# EAGLE design actuatorboard (EAGLE 8.7.1)
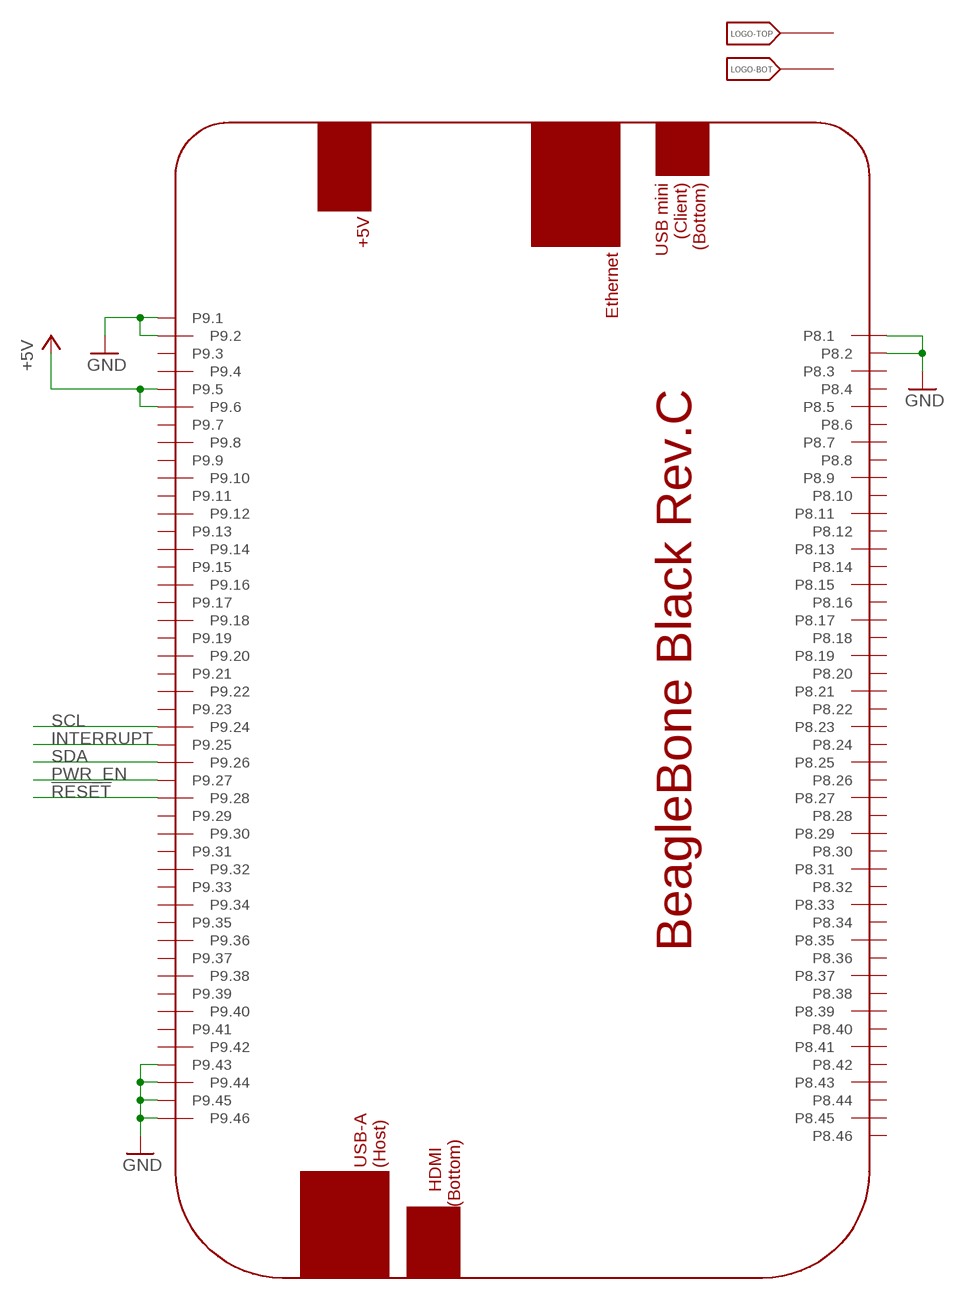
[diagram p0: schematic, sheet 1, part 1 of 2]
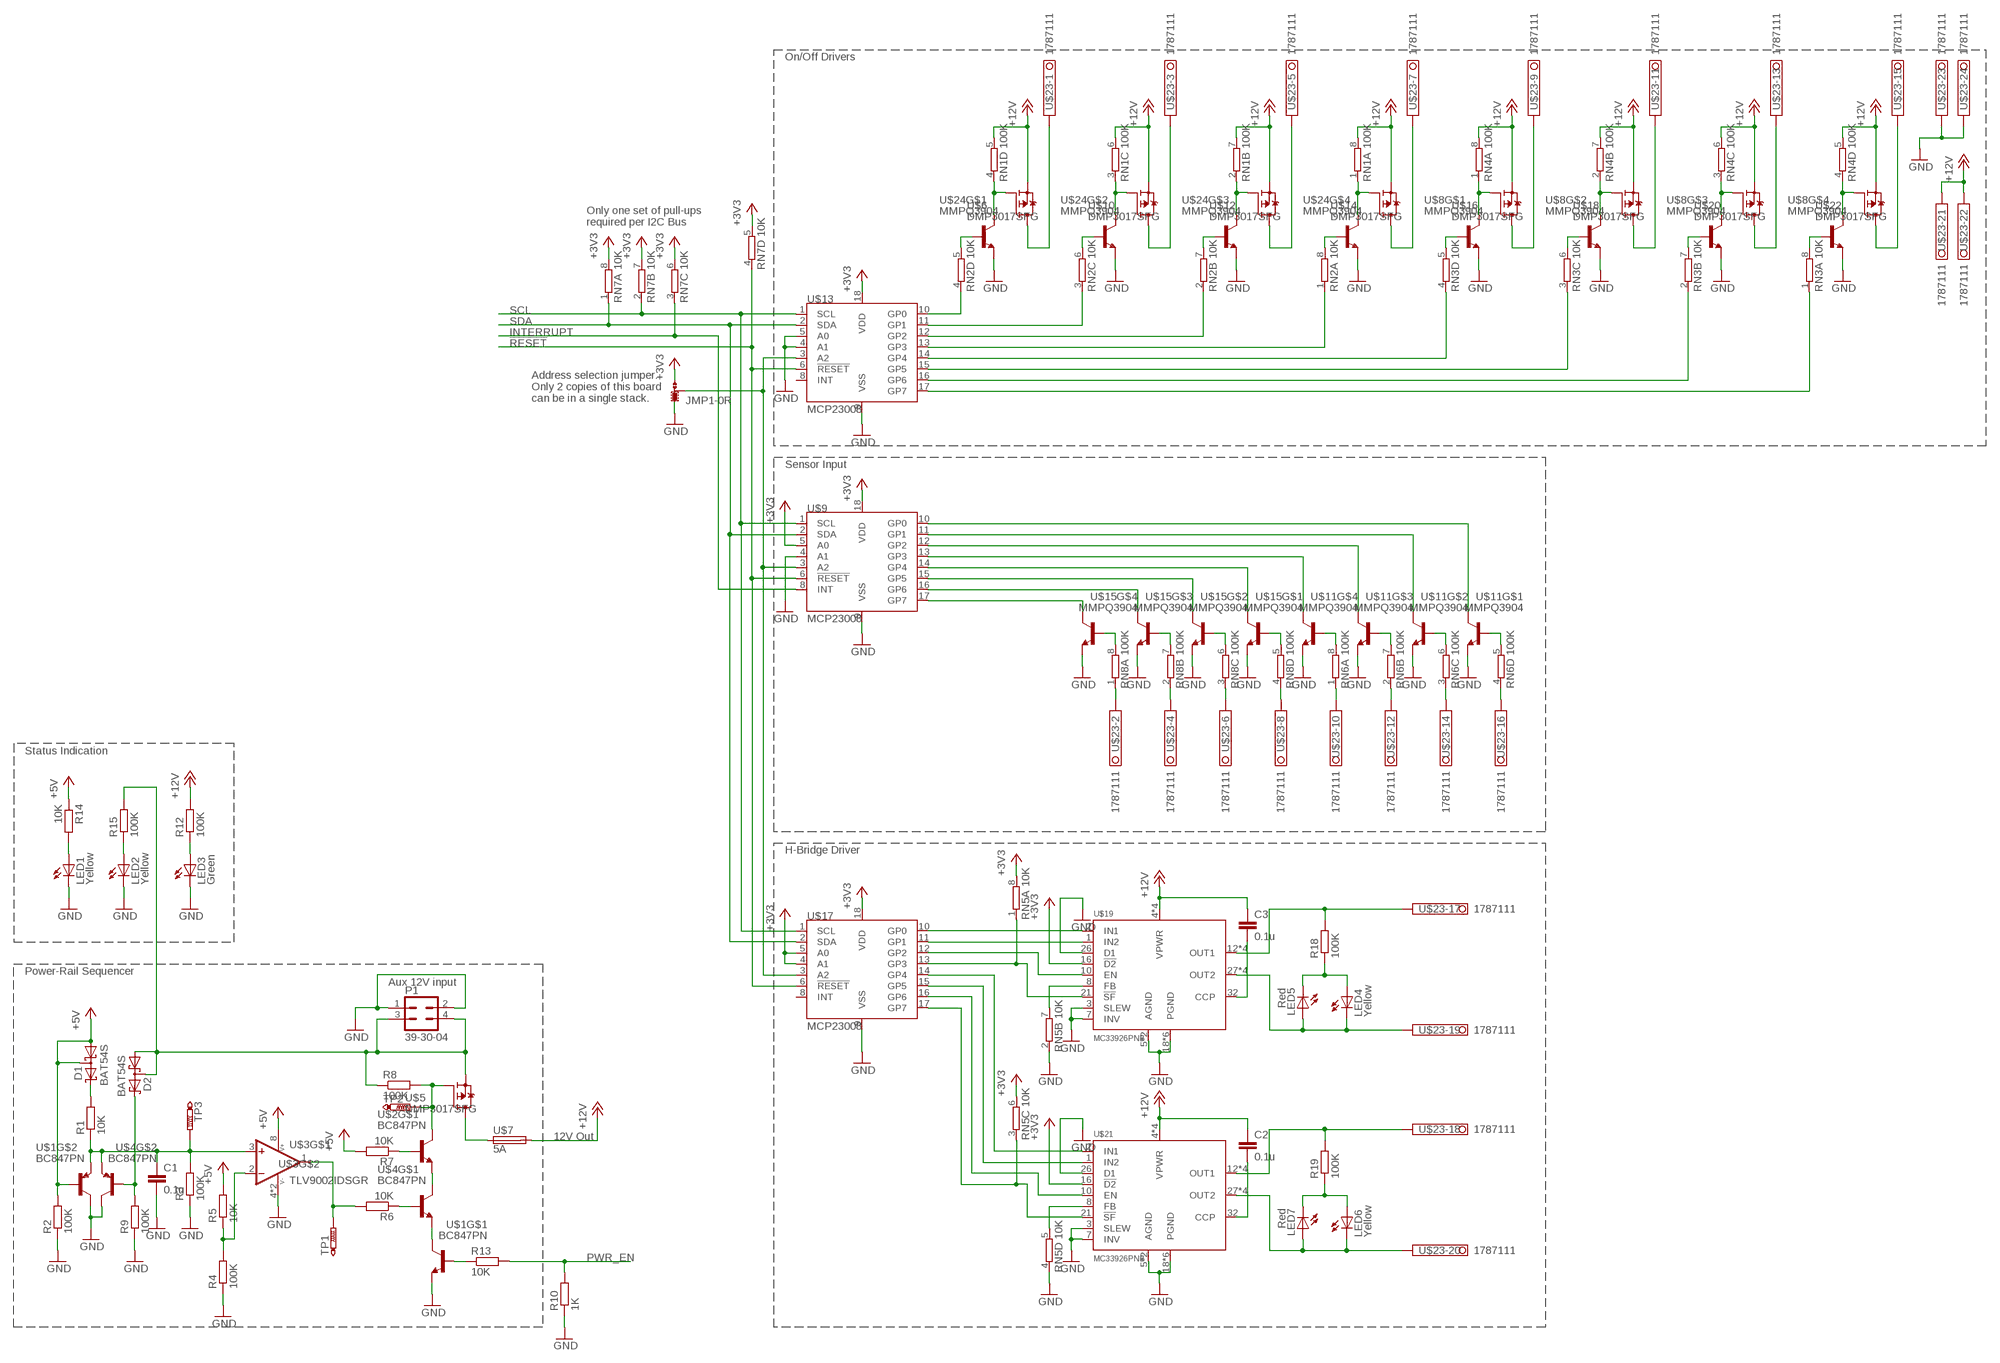
[diagram p1: schematic, sheet 1, part 2 of 2]

## Parts
C1  0.1u  C-EUC0805  [C0805]
C2  0.1u  C-EUC0805  [C0805]
C3  0.1u  C-EUC0805  [C0805]
D1  BAT54S  [SOT23]
D2  BAT54S  [SOT23]
JMP1  0R-JUMPA  [A0R-JMP]
LED1  Yellow  LEDCHIPLED_0805  [CHIPLED_0805]
LED2  Yellow  LEDCHIPLED_0805  [CHIPLED_0805]
LED3  Green  LEDCHIPLED_0805  [CHIPLED_0805]
LED4  Yellow  LEDCHIPLED_0805  [CHIPLED_0805]
LED5  Red  LEDCHIPLED_0805  [CHIPLED_0805]
LED6  Yellow  LEDCHIPLED_0805  [CHIPLED_0805]
LED7  Red  LEDCHIPLED_0805  [CHIPLED_0805]
LOGO  SU_LOGO-DUMMY  [SU_LOGO_DS]
P1  39-30-04  [39-30-?04?]
PCB1  BEAGLEBONE_BLACK_CAPENO_ETH  [BEAGLEBONE_BLACK_CAPE_NO_ETH]
R1  10K  R-EU_R0805  [R0805]
R2  100K  R-EU_R0805  [R0805]
R3  100K  R-EU_R0805  [R0805]
R4  100K  R-EU_R0805  [R0805]
R5  10K  R-EU_R0805  [R0805]
R6  10K  R-EU_R0805  [R0805]
R7  10K  R-EU_R0805  [R0805]
R8  100K  R-EU_R0805  [R0805]
R9  100K  R-EU_R0805  [R0805]
R10  1K  R-EU_R0805  [R0805]
R12  100K  R-EU_R0805  [R0805]
R13  10K  R-EU_R0805  [R0805]
R14  10K  R-EU_R0805  [R0805]
R15  100K  R-EU_R0805  [R0805]
R18  100K  R-EU_R0805  [R0805]
R19  100K  R-EU_R0805  [R0805]
RN1  100K  4R-NEXBV8V  [EXBV8V]
RN2  10K  4R-NEXBV8V  [EXBV8V]
RN3  10K  4R-NEXBV8V  [EXBV8V]
RN4  100K  4R-NEXBV8V  [EXBV8V]
RN5  10K  4R-NEXBV8V  [EXBV8V]
RN6  100K  4R-NEXBV8V  [EXBV8V]
RN7  10K  4R-NEXBV8V  [EXBV8V]
RN8  100K  4R-NEXBV8V  [EXBV8V]
TP1  PTR1B1,27  [B1,27]
TP2  PTR1B1,27  [B1,27]
TP3  PTR1B1,27  [B1,27]
U$1  BC847PN  [SOT363-INFINION]
U$2  BC847PN  [SOT363-INFINION]
U$3  TLV9002IDSGR  [S-PWSON-N8]
U$4  BC847PN  [SOT363-INFINION]
U$5  DMP3017SFG  [POWERDI3333-8]
U$6  DMP3017SFG  [POWERDI3333-8]
U$7  5A  SMD1206  [SMD-1206]
U$8  MMPQ3904  [SOIC-16]
U$9  MCP23008  [SO-18W]
U$10  DMP3017SFG  [POWERDI3333-8]
U$11  MMPQ3904  [SOIC-16]
U$12  DMP3017SFG  [POWERDI3333-8]
U$13  MCP23008  [SO-18W]
U$14  DMP3017SFG  [POWERDI3333-8]
U$15  MMPQ3904  [SOIC-16]
U$16  DMP3017SFG  [POWERDI3333-8]
U$17  MCP23008  [SO-18W]
U$18  DMP3017SFG  [POWERDI3333-8]
U$19  MC33926PNB  [PQFN-32]
U$20  DMP3017SFG  [POWERDI3333-8]
U$21  MC33926PNB  [PQFN-32]
U$22  DMP3017SFG  [POWERDI3333-8]
U$23  1787111  [1787111]
U$24  MMPQ3904  [SOIC-16]

## Nets
!RESET!: PCB1.P9.28 RN7.4 U$9.6(!RESET!) U$13.6(!RESET!) U$17.6(!RESET!)
+3V3: JMP1.3 RN5.6 RN5.8 RN7.5 RN7.6 RN7.7 RN7.8 U$9.5(A0) U$9.18(VDD) U$13.18(VDD) U$17.4(A1) U$17.5(A0) U$17.18(VDD) U$19.16(!D2!) U$21.16(!D2!)
+5V: D1.1(A1) D1.3(C1A2) PCB1.P9.5 PCB1.P9.6 R2.2 R5.2 R7.2 R14.1 U$1.5(B) U$3.8(V+)
+12V: C2.1 C3.1 R12.2 RN1.5 RN1.6 RN1.7 RN1.8 RN4.5 RN4.6 RN4.7 RN4.8 U$6.P$1(S) U$6.P$2(S) U$6.P$3(S) U$7.2 U$10.P$1(S) U$10.P$2(S) U$10.P$3(S) U$12.P$1(S) U$12.P$2(S) U$12.P$3(S) U$14.P$1(S) U$14.P$2(S) U$14.P$3(S) U$16.P$1(S) U$16.P$2(S) U$16.P$3(S) U$18.P$1(S) U$18.P$2(S) U$18.P$3(S) U$19.4(VPWR) U$19.6(VPWR) U$19.11(VPWR) U$19.31(VPWR) U$20.P$1(S) U$20.P$2(S) U$20.P$3(S) U$21.4(VPWR) U$21.6(VPWR) U$21.11(VPWR) U$21.31(VPWR) U$22.P$1(S) U$22.P$2(S) U$22.P$3(S) U$23.21 U$23.22
GND: C1.2 JMP1.1 LED1.C LED2.C LED3.C P1.1 P1.2 PCB1.P8.1 PCB1.P8.2 PCB1.P9.1 PCB1.P9.2 PCB1.P9.43 PCB1.P9.44 PCB1.P9.45 PCB1.P9.46 R2.1 R3.1 R4.1 R9.1 R10.1 RN5.2 RN5.4 U$1.1(E) U$1.3(C) U$3.4(V-) U$3.PAD(V-) U$4.3(C) U$8.P$10(E) U$8.P$12(E) U$8.P$14(E) U$8.P$16(E) U$9.4(A1) U$9.9(VSS) U$11.P$10(E) U$11.P$12(E) U$11.P$14(E) U$11.P$16(E) U$13.4(A1) U$13.5(A0) U$13.9(VSS) U$15.P$10(E) U$15.P$12(E) U$15.P$14(E) U$15.P$16(E) U$17.9(VSS) U$19.3(SLEW) U$19.5(AGND) U$19.7(INV) U$19.18(PGND) U$19.19(PGND) U$19.20(PGND) U$19.22(PGND) U$19.23(PGND) U$19.24(PGND) U$19.26(D1) U$19.PAD(AGND) U$21.3(SLEW) U$21.5(AGND) U$21.7(INV) U$21.18(PGND) U$21.19(PGND) U$21.20(PGND) U$21.22(PGND) U$21.23(PGND) U$21.24(PGND) U$21.26(D1) U$21.PAD(AGND) U$23.23 U$23.24 U$24.P$10(E) U$24.P$12(E) U$24.P$14(E) U$24.P$16(E)
INTERRUPT: PCB1.P9.25 RN7.3 U$9.8(INT)
N$1: D2.2(C2) R9.2 U$4.5(B)
N$2: C1.1 R1.1 R3.2 TP3.TP U$1.4(E) U$3.3(+IN) U$4.4(E)
N$3: R4.2 R5.1 U$3.2(-IN)
N$4: U$1.6(C) U$4.1(E)
N$5: R6.1 U$4.2(B)
N$6: R6.2 TP1.TP U$3.1(OUT)
N$7: U$2.1(E) U$4.6(C)
N$8: U$5.P$5(D) U$5.P$6(D) U$5.P$7(D) U$5.P$8(D) U$7.1
N$9: R7.1 U$2.2(B)
N$10: D1.2(C2) R1.2
N$11: U$6.P$5(D) U$6.P$6(D) U$6.P$7(D) U$6.P$8(D) U$23.1
N$12: D2.1(A1) D2.3(C1A2) P1.3 P1.4 R8.1 R15.2 U$5.P$1(S) U$5.P$2(S) U$5.P$3(S)
N$13: R8.2 TP2.TP U$2.6(C) U$5.P$4(G)
N$14: R13.1 U$1.2(B)
N$15: RN1.4 U$6.P$4(G) U$24.P$1(C) U$24.P$2(C)
N$16: RN2.4 U$13.10(GP0)
N$17: RN2.5 U$24.P$15(B)
N$18: U$17.10(GP0) U$19.2(IN1)
N$19: U$17.11(GP1) U$19.1(IN2)
N$20: LED1.A R14.2
N$21: LED2.A R15.1
N$22: LED3.A R12.1
N$23: U$10.P$5(D) U$10.P$6(D) U$10.P$7(D) U$10.P$8(D) U$23.3
N$24: RN1.3 U$10.P$4(G) U$24.P$3(C) U$24.P$4(C)
N$25: RN2.6 U$24.P$13(B)
N$26: RN2.3 U$13.11(GP1)
N$27: U$12.P$5(D) U$12.P$6(D) U$12.P$7(D) U$12.P$8(D) U$23.5
N$28: RN1.2 U$12.P$4(G) U$24.P$5(C) U$24.P$6(C)
N$29: RN2.7 U$24.P$11(B)
N$30: RN2.2 U$13.12(GP2)
N$31: U$14.P$5(D) U$14.P$6(D) U$14.P$7(D) U$14.P$8(D) U$23.7
N$32: RN1.1 U$14.P$4(G) U$24.P$7(C) U$24.P$8(C)
N$33: RN2.8 U$24.P$9(B)
N$34: RN2.1 U$13.13(GP3)
N$35: U$17.12(GP2) U$19.10(EN)
N$36: RN6.2 U$23.12
N$37: U$16.P$5(D) U$16.P$6(D) U$16.P$7(D) U$16.P$8(D) U$23.9
N$38: RN4.1 U$8.P$1(C) U$8.P$2(C) U$16.P$4(G)
N$39: RN3.5 U$8.P$15(B)
N$40: RN3.4 U$13.14(GP4)
N$41: U$18.P$5(D) U$18.P$6(D) U$18.P$7(D) U$18.P$8(D) U$23.11
N$42: RN4.2 U$8.P$3(C) U$8.P$4(C) U$18.P$4(G)
N$43: RN3.6 U$8.P$13(B)
N$44: RN3.3 U$13.15(GP5)
N$45: U$20.P$5(D) U$20.P$6(D) U$20.P$7(D) U$20.P$8(D) U$23.13
N$46: RN4.3 U$8.P$5(C) U$8.P$6(C) U$20.P$4(G)
N$47: RN3.7 U$8.P$11(B)
N$48: RN3.2 U$13.16(GP6)
N$49: U$22.P$5(D) U$22.P$6(D) U$22.P$7(D) U$22.P$8(D) U$23.15
N$50: RN4.4 U$8.P$7(C) U$8.P$8(C) U$22.P$4(G)
N$51: RN3.8 U$8.P$9(B)
N$52: RN3.1 U$13.17(GP7)
N$53: U$9.10(GP0) U$11.P$1(C) U$11.P$2(C)
N$54: U$9.11(GP1) U$11.P$3(C) U$11.P$4(C)
N$55: RN6.5 U$11.P$15(B)
N$56: U$9.12(GP2) U$11.P$5(C) U$11.P$6(C)
N$57: U$9.13(GP3) U$11.P$7(C) U$11.P$8(C)
N$58: U$9.14(GP4) U$15.P$1(C) U$15.P$2(C)
N$59: U$9.15(GP5) U$15.P$3(C) U$15.P$4(C)
N$60: U$9.16(GP6) U$15.P$5(C) U$15.P$6(C)
N$61: U$9.17(GP7) U$15.P$7(C) U$15.P$8(C)
N$62: RN6.6 U$11.P$13(B)
N$63: RN6.7 U$11.P$11(B)
N$64: RN6.8 U$11.P$9(B)
N$65: RN8.5 U$15.P$15(B)
N$66: RN5.1 U$17.13(GP3) U$19.21(!SF!)
N$67: RN5.7 U$19.8(FB)
N$68: U$17.14(GP4) U$21.2(IN1)
N$69: U$17.15(GP5) U$21.1(IN2)
N$70: RN8.6 U$15.P$13(B)
N$71: RN8.7 U$15.P$11(B)
N$72: RN8.8 U$15.P$9(B)
N$73: U$17.16(GP6) U$21.10(EN)
N$74: RN5.3 U$17.17(GP7) U$21.21(!SF!)
N$75: RN5.5 U$21.8(FB)
N$76: LED4.A LED5.C R18.1
N$77: LED4.C LED5.A U$19.27(OUT2) U$19.28(OUT2) U$19.29(OUT2) U$19.30(OUT2) U$23.19
N$78: RN8.1 U$23.2
N$79: R18.2 U$19.12(OUT1) U$19.13(OUT1) U$19.14(OUT1) U$19.15(OUT1) U$23.17
N$80: LED6.A LED7.C R19.1
N$81: LED6.C LED7.A U$21.27(OUT2) U$21.28(OUT2) U$21.29(OUT2) U$21.30(OUT2) U$23.20
N$82: R19.2 U$21.12(OUT1) U$21.13(OUT1) U$21.14(OUT1) U$21.15(OUT1) U$23.18
N$83: C2.2 U$21.32(CCP)
N$84: C3.2 U$19.32(CCP)
N$85: RN8.2 U$23.4
N$86: RN8.3 U$23.6
N$87: RN8.4 U$23.8
N$88: RN6.1 U$23.10
N$89: RN6.3 U$23.14
N$90: RN6.4 U$23.16
N$92: JMP1.2 U$9.3(A2) U$13.3(A2) U$17.3(A2)
PWR_EN: PCB1.P9.27 R10.2 R13.2
SCL: PCB1.P9.24 RN7.2 U$9.1(SCL) U$13.1(SCL) U$17.1(SCL)
SDA: PCB1.P9.26 RN7.1 U$9.2(SDA) U$13.2(SDA) U$17.2(SDA)
Unconnected: LOGO.P$1 LOGO.P$2 PCB1.P8.3 PCB1.P8.4 PCB1.P8.5 PCB1.P8.6 PCB1.P8.7 PCB1.P8.8 PCB1.P8.9 PCB1.P8.10 PCB1.P8.11 PCB1.P8.12 PCB1.P8.13 PCB1.P8.14 PCB1.P8.15 PCB1.P8.16 PCB1.P8.17 PCB1.P8.18 PCB1.P8.19 PCB1.P8.20 PCB1.P8.21 PCB1.P8.22 PCB1.P8.23 PCB1.P8.24 PCB1.P8.25 PCB1.P8.26 PCB1.P8.27 PCB1.P8.28 PCB1.P8.29 PCB1.P8.30 PCB1.P8.31 PCB1.P8.32 PCB1.P8.33 PCB1.P8.34 PCB1.P8.35 PCB1.P8.36 PCB1.P8.37 PCB1.P8.38 PCB1.P8.39 PCB1.P8.40 PCB1.P8.41 PCB1.P8.42 PCB1.P8.43 PCB1.P8.44 PCB1.P8.45 PCB1.P8.46 PCB1.P9.3 PCB1.P9.4 PCB1.P9.7 PCB1.P9.8 PCB1.P9.9 PCB1.P9.10 PCB1.P9.11 PCB1.P9.12 PCB1.P9.13 PCB1.P9.14 PCB1.P9.15 PCB1.P9.16 PCB1.P9.17 PCB1.P9.18 PCB1.P9.19 PCB1.P9.20 PCB1.P9.21 PCB1.P9.22 PCB1.P9.23 PCB1.P9.29 PCB1.P9.30 PCB1.P9.31 PCB1.P9.32 PCB1.P9.33 PCB1.P9.34 PCB1.P9.35 PCB1.P9.36 PCB1.P9.37 PCB1.P9.38 PCB1.P9.39 PCB1.P9.40 PCB1.P9.41 PCB1.P9.42 U$2.3(C) U$2.4(E) U$2.5(B) U$3.5(+IN) U$3.6(-IN) U$3.7(OUT) U$13.8(INT) U$17.8(INT)

## Notes on the sheet
- On/Off Drivers
- Only one set of pull-ups 
  required per I2C Bus
- Address selection jumper.
  Only 2 copies of this board
  can be in a single stack.
- Sensor Input
- Status Indication
- H-Bridge Driver
- Power-Rail Sequencer
- Aux 12V input
- 12V Out

## Library data of the parts
C1-C3 = rcl:C-EU: CAPACITOR, European symbol
D1 D2 = diode:BAT54S: Schottky Diodes Pin connection corrected 2011-05-04 Source: Fairchild .. BAT54.pdf
JMP1 = jump-0r-smd:0R-JUMP: SMD 0R 0805 Jumper
LED1-LED7 = led:LED: LED OSRAM: - CHIPLED LG R971, LG N971, LY N971, LG Q971, LY Q971, LO R971, LY R971 LH N974, LH R974 LS Q976, LO Q976, LY Q976 LO Q996 - Hyper CHIPLED LW Q18S LB Q993, LB Q99A, LB R99A - SideLED LS A670, LO A670, LY A670, LG A670, LP A670 LB A673, LV A673, LT A673, LW A673 LH A674 LY A675 LS A676, LA A676, LO A676, LY A676, LW A676 LS A679, LY A679, LG A679 - Hyper Micro SIDELED® LS Y876, LA Y876, LO Y876, LY Y876 LT Y87S - SmartLED LW L88C, LW L88S LB L89C, LB L89S, LG L890 LS L89K, LO L89K, LY L89K LS L896, LA L896, LO L896, LY L896 - TOPLED LS T670, LO T670, LY T670, LG T670, LP T670 LSG T670, LSP T670, LSY T670, LOP T670, LYG T670 LG T671, LOG T671, LSG T671 LB T673, LV T673, LT T673, LW T673 LH T674 LS T676, LA T676, LO T676, LY T676, LB T676, LH T676, LSB T676, LW T676 LB T67C, LV T67C, LT T67C, LS T67K, LO T67K, LY T67K, LW E67C LS E67B, LA E67B, LO E67B, LY E67B, LB E67C, LV E67C, LT E67C LW T67C LS T679, LY T679, LG T679 LS T770, LO T770, LY T770, LG T770, LP T770 LB T773, LV T773, LT T773, LW T773 LH T774 LS E675, LA E675, LY E675, LS T675 LS T776, LA T776, LO T776, LY T776, LB T776 LHGB T686 LT T68C, LB T68C - Hyper Mini TOPLED® LB M676 - Mini TOPLED Santana® LG M470 LS M47K, LO M47K, LY M47K Source: http://www.osram.convergy.de LUXEON: - LUMILED® LXK2-PW12-R00, LXK2-PW12-S00, LXK2-PW14-U00, LXK2-PW14-V00 LXK2-PM12-R00, LXK2-PM12-S00, LXK2-PM14-U00 LXK2-PE12-Q00, LXK2-PE12-R00, LXK2-PE12-S00, LXK2-PE14-T00, LXK2-PE14-U00 LXK2-PB12-K00, LXK2-PB12-L00, LXK2-PB12-M00, LXK2-PB14-N00, LXK2-PB14-P00, LXK2-PB14-Q00 LXK2-PR12-L00, LXK2-PR12-M00, LXK2-PR14-Q00, LXK2-PR14-R00 LXK2-PD12-Q00, LXK2-PD12-R00, LXK2-PD12-S00 LXK2-PH12-R00, LXK2-PH12-S00 LXK2-PL12-P00, LXK2-PL12-Q00, LXK2-PL12-R00 Source: www.luxeon.com KINGBRIGHT: KA-3528ASYC Source: www.kingbright.com
LOGO = components:SU_LOGO-DUMMY
P1 = con-molex-mini-fit:39-30-?04?: HEADER
PCB1 = e14_BeagleBoneBlack_RevB:BEAGLEBONE_BLACK_CAPE
R1-R10 R12-R15 R18 R19 = rcl:R-EU_: RESISTOR, European symbol
RN1-RN8 = resistor-dil:4R-N: Array Chip Resistor Source: RS Component / Phycomp; OC_FARNELL: unknown; OC_NEWARK: unknown
TP1-TP3 = testpad:PTR1: TEST PIN
U$1 U$2 U$4 = transistor:BC847PN: NPN/PNP Transistor array 1 NPN, 1 PNP
U$3 = texas:TLV: OP Amp Low-power rail-to-rail opperational amplifier. 1.8 - 5.5V
U$5 U$6 U$10 U$12 U$14 U$16 U$18 U$20 U$22 = transistor-fet:DMP3017SFG: P-Channel Mosfet Depricated! Replaced by: DMP3013SFV Id - Continuous Drain Current: - 30 A Pd - Power Dissipation: 31 W Vgs th - Gate-Source Threshold Voltage: - 1 V
U$7 = fuse:SMD: SMD Fuse
U$8 U$11 U$15 U$24 = on-semiconductor:MMPQ3904: NPN Transistor Array Quad NPN Transistor array
U$9 U$13 U$17 = microchip:MCP23008: 8-Bit IO-Expander I2C/SPI 8-Bit I/O Expander with Serial Interface.
U$19 U$21 = nxp:MC33926: H-Bridge 5A 5.0A trottle conrol H-bridge
U$23 = con-phoenix-350:1787111: DMC_1,5/12-G1F-3,5-LR_P20THR Pluggable Terminal Blocks 12 Pos 3.5mm Dbl Row Through Hole Header

## Net classes
0 default: clearance 0.205 mm

## Board
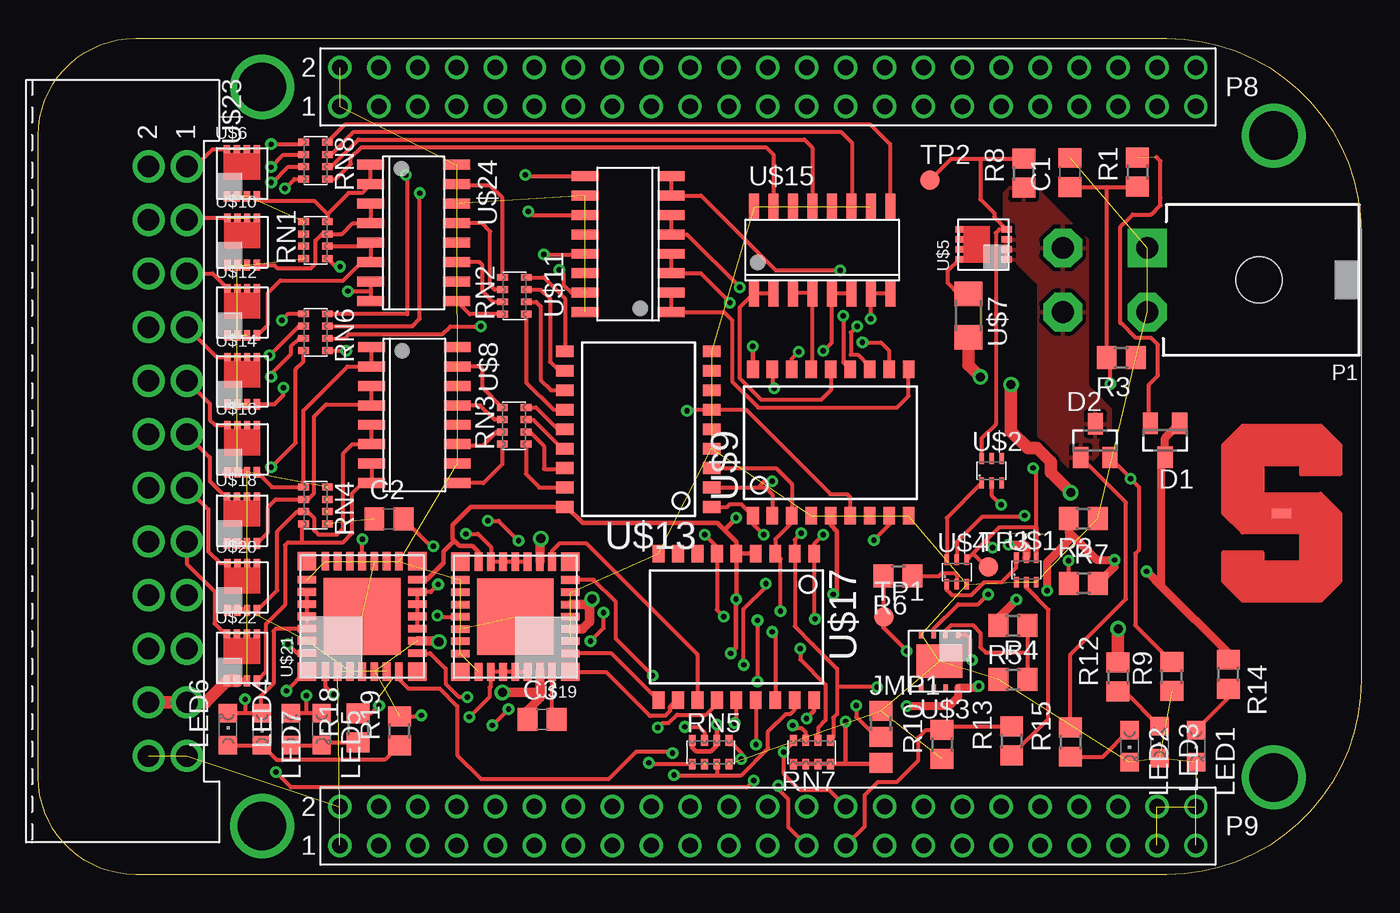
[diagram p2: board, top side]
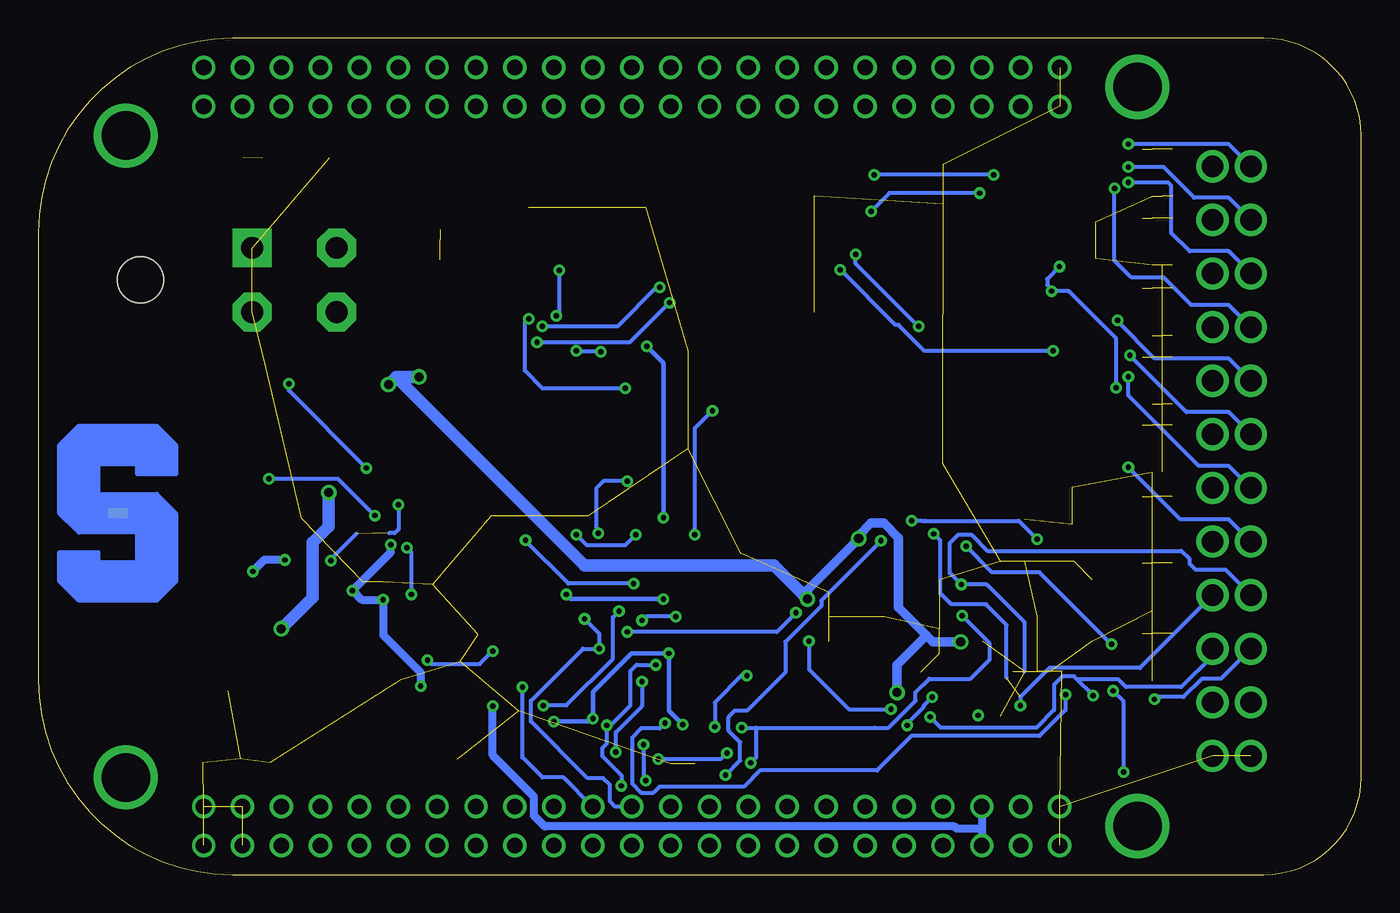
[diagram p3: board, bottom side, seen from below]

Size 86.36 x 54.61 mm. Coordinates in mm from the lower left corner, seen from the top.
Copper layers (1*16): Top 0.035mm / dielectric 1.5mm / Bottom 0.035mm
Design rules "default": minimum track width 10mil, minimum drill 24mil, track to track 8mil, track to pad 8mil, pad to pad 8mil, via to via 8mil, smd to smd 8mil, copper to edge 40mil, drill to drill 8mil, minimum pad ring 10mil, minimum via ring 8mil, stop-mask expansion 4mil, vias tented up to drill 0mil, thermal gap 10mil

### Footprints (pad centres in the part's own frame; a part is rotated, then mirrored left to right if it is on the bottom)
C0805 = smd 1.3 x 1.5: 1 -0.95,0; 2 0.95,0
SOT23 = smd 1 x 1.4: 1 -0.95,-1.1; 2 0.95,-1.1; 3 0,1.1
A0R-JMP = smd 1.5 x 1.3: 1 0,1.7; 2 0,0; 3 0,-1.7
CHIPLED_0805 = smd 1.2 x 1.2: A 0,-1.05; C 0,1.05
SU_LOGO_DS = smd 1.27 x 0.635: P$1 0,0 | smd 1.27 x 0.635 bottom: P$2 0,0
39-30-?04? = drill 1.422 pad 2.54 square: 1 2.095,0 | drill 1.422 pad 2.54 octagon: 2 -2.095,0; 3 2.095,5.512; 4 -2.095,5.512 | hole 3: 0,-7.3
BEAGLEBONE_BLACK_CAPE_NO_ETH = drill 3.175: H1 14.605,3.175; H2 80.645,6.35; H3 80.645,48.26; H4 14.605,51.435 | drill 1.016: P8.1 19.685,50.165; P8.2 19.685,52.705; P8.3 22.225,50.165; P8.4 22.225,52.705; P8.5 24.765,50.165; P8.6 24.765,52.705; P8.7 27.305,50.165; P8.8 27.305,52.705; P8.9 29.845,50.165; P8.10 29.845,52.705; P8.11 32.385,50.165; P8.12 32.385,52.705; P8.13 34.925,50.165; P8.14 34.925,52.705; P8.15 37.465,50.165; P8.16 37.465,52.705; P8.17 40.005,50.165; P8.18 40.005,52.705; P8.19 42.545,50.165; P8.20 42.545,52.705; P8.21 45.085,50.165; P8.22 45.085,52.705; P8.23 47.625,50.165; P8.24 47.625,52.705; P8.25 50.165,50.165; P8.26 50.165,52.705; P8.27 52.705,50.165; P8.28 52.705,52.705; P8.29 55.245,50.165; P8.30 55.245,52.705; P8.31 57.785,50.165; P8.32 57.785,52.705; P8.33 60.325,50.165; P8.34 60.325,52.705; P8.35 62.865,50.165; P8.36 62.865,52.705; P8.37 65.405,50.165; P8.38 65.405,52.705; P8.39 67.945,50.165; P8.40 67.945,52.705; P8.41 70.485,50.165; P8.42 70.485,52.705; P8.43 73.025,50.165; P8.44 73.025,52.705; P8.45 75.565,50.165; P8.46 75.565,52.705; P9.1 19.685,1.905; P9.2 19.685,4.445; P9.3 22.225,1.905; P9.4 22.225,4.445; P9.5 24.765,1.905; P9.6 24.765,4.445; P9.7 27.305,1.905; P9.8 27.305,4.445; P9.9 29.845,1.905; P9.10 29.845,4.445; P9.11 32.385,1.905; P9.12 32.385,4.445; P9.13 34.925,1.905; P9.14 34.925,4.445; P9.15 37.465,1.905; P9.16 37.465,4.445; P9.17 40.005,1.905; P9.18 40.005,4.445; P9.19 42.545,1.905; P9.20 42.545,4.445; P9.21 45.085,1.905; P9.22 45.085,4.445; P9.23 47.625,1.905; P9.24 47.625,4.445; P9.25 50.165,1.905; P9.26 50.165,4.445; P9.27 52.705,1.905; P9.28 52.705,4.445; P9.29 55.245,1.905; P9.30 55.245,4.445; P9.31 57.785,1.905; P9.32 57.785,4.445; P9.33 60.325,1.905; P9.34 60.325,4.445; P9.35 62.865,1.905; P9.36 62.865,4.445; P9.37 65.405,1.905; P9.38 65.405,4.445; P9.39 67.945,1.905; P9.40 67.945,4.445; P9.41 70.485,1.905; P9.42 70.485,4.445; P9.43 73.025,1.905; P9.44 73.025,4.445; P9.45 75.565,1.905; P9.46 75.565,4.445
R0805 = smd 1.3 x 1.5: 1 -0.95,0; 2 0.95,0
EXBV8V = smd 0.45 x 0.7: 1 -1.2,-0.775; 2 -0.4,-0.775; 3 0.4,-0.775; 4 1.2,-0.775; 5 1.2,0.775; 6 0.4,0.775; 7 -0.4,0.775; 8 -1.2,0.775
B1,27 = smd 1.27 x 1.27: TP 0,0
SOT363-INFINION = smd 0.3 x 0.7: 1 -0.65,-0.8; 2 0,-0.8; 3 0.65,-0.8; 4 0.65,0.8; 5 0,0.8; 6 -0.65,0.8
S-PWSON-N8 = smd 0.3 x 0.5: 1 -1.2,-1.75; 2 -0.4,-1.75; 3 0.4,-1.75; 4 1.2,-1.75; 5 1.2,1.75; 6 0.4,1.75; 7 -0.4,1.75; 8 -1.2,1.75 | smd 3 x 2.2: PAD 0,0
POWERDI3333-8 = smd 0.42 x 0.7: P$1 -0.975,-1.5; P$2 -0.325,-1.5; P$3 0.325,-1.5; P$4 0.975,-1.5 | smd 0.42 x 0.54: P$5 0.975,1.58; P$6 0.325,1.58; P$7 -0.325,1.58; P$8 -0.975,1.58
SMD-1206 = smd 1.6 x 1.803: 1 -1.422,0; 2 1.422,0
SOIC-16 = smd 0.65 x 1.75: P$1 -4.445,-2.8; P$2 -3.175,-2.8; P$3 -1.905,-2.8; P$4 -0.635,-2.8; P$5 0.635,-2.8; P$6 1.905,-2.8; P$7 3.175,-2.8; P$8 4.445,-2.8; P$9 4.445,2.8; P$10 3.175,2.8; P$11 1.905,2.8; P$12 0.635,2.8; P$13 -0.635,2.8; P$14 -1.905,2.8; P$15 -3.175,2.8; P$16 -4.445,2.8
SO-18W = smd 0.762 x 1.143: 1 -5.08,-4.788; 2 -3.81,-4.788; 3 -2.54,-4.788; 4 -1.27,-4.788; 5 0,-4.788; 6 1.27,-4.788; 7 2.54,-4.788; 8 3.81,-4.788; 9 5.08,-4.788; 10 5.08,4.788; 11 3.81,4.788; 12 2.54,4.788; 13 1.27,4.788; 14 0,4.788; 15 -1.27,4.788; 16 -2.54,4.788; 17 -3.81,4.788; 18 -5.08,4.788
PQFN-32 = smd 1.2 x 1.2: 1 -3.6,3.6; 9 -3.6,-3.6; 17 3.6,-3.6; 25 3.6,3.6 | smd 1.2 x 0.5: 2 -3.6,2.4; 3 -3.6,1.6; 4 -3.6,0.8; 5 -3.6,0; 6 -3.6,-0.8; 7 -3.6,-1.6; 8 -3.6,-2.4; 18 3.6,-2.4; 19 3.6,-1.6; 20 3.6,-0.8; 21 3.6,0; 22 3.6,0.8; 23 3.6,1.6; 24 3.6,2.4 | smd 0.5 x 1.2: 10 -2.4,-3.6; 11 -1.6,-3.6; 12 -0.8,-3.6; 13 0,-3.6; 14 0.8,-3.6; 15 1.6,-3.6; 16 2.4,-3.6; 26 2.4,3.6; 27 1.6,3.6; 28 0.8,3.6; 29 0,3.6; 30 -0.8,3.6; 31 -1.6,3.6; 32 -2.4,3.6 | smd 5 x 5: PAD 0,0
1787111 = drill 1.4: 1 -19.25,4.7; 2 -19.25,2.2; 3 -15.75,4.7; 4 -15.75,2.2; 5 -12.25,4.7; 6 -12.25,2.2; 7 -8.75,4.7; 8 -8.75,2.2; 9 -5.25,4.7; 10 -5.25,2.2; 11 -1.75,4.7; 12 -1.75,2.2; 13 1.75,4.7; 14 1.75,2.2; 15 5.25,4.7; 16 5.25,2.2; 17 8.75,4.7; 18 8.75,2.2; 19 12.25,4.7; 20 12.25,2.2; 21 15.75,4.7; 22 15.75,2.2; 23 19.25,4.7; 24 19.25,2.2

### Placement (x,y rotation side)
C1  67.35,45.85 90 top
C2  22.89,23.22 0 top
C3  32.89,10.14 0 top
D1  73.55,28.36 180 top
D2  69,28.34 0 top
JMP1  55,9 0 top
LED1  75.59,8.4 180 top
LED2  71.24,8.4 180 top
LED3  73.19,8.65 180 top
LED4  16.5,9.5 0 top
LED5  18.5,9.5 180 top
LED6  12.39,9.5 0 top
LED7  14.61,9.5 180 top
LOGO  81.17,23.6 0 top
P1  39-30-04?  [39-30-?04?]  72.39,38.83 90 top
PCB1  0,0 0 top
R1  71.75,45.87 90 top
R2  68.21,23.25 180 top
R3  70.69,33.75 180 top
R4  63.63,12.75 0 top
R5  63.62,16.26 180 top
R6  56.12,19.5 180 top
R7  68.23,19.02 0 top
R8  64.33,45.8 90 top
R9  73.99,12.94 90 top
R10  59,8.5 90 top
R12  70.48,12.91 90 top
R13  63.54,8.73 90 top
R14  77.67,13.09 270 top
R15  67.38,8.66 90 top
R18  20.88,9.59 90 top
R19  23.58,9.39 90 top
RN1  18.1,41.43 90 top
RN2  31.08,37.8 90 top
RN3  31.06,29.31 90 top
RN4  18.09,24.11 270 top
RN5  43.89,8 0 top
RN6  18.09,35.42 270 top
RN7  50.5,8 180 top
RN8  18.09,46.62 270 top
TP1  55.21,16.84 0 top
TP2  58.21,45.36 0 top
TP3  62.01,20.08 0 top
U$1  64.5,19.9 0 top
U$2  62.23,26.37 0 top
U$3  58.84,13.94 180 top
U$4  59.96,19.76 0 top
U$5  61.71,41.15 90 top
U$6  13.3,45.79 0 top
U$7  60.72,36.5 270 top
U$8  24.55,30.01 270 top
U$9  51.73,28.21 0 top
U$10  13.31,41.3 0 top
U$11  38.5,41.17 90 top
U$12  13.31,36.71 0 top
U$13  39.17,29.09 90 top
U$14  13.31,32.22 0 top
U$15  51.17,40.78 0 top
U$16  13.31,27.78 0 top
U$17  45.57,16.17 180 top
U$18  13.3,23.12 0 top
U$19  31.14,16.84 180 top
U$20  13.31,18.76 0 top
U$21  21.14,16.86 90 top
U$22  13.3,14.16 0 top
U$23  5,27 270 top
U$24  24.5,41.9 270 top

### Tracks (layer width: path | path; a pad name or v marks a point on that pad's centre or on a via)
!RESET!  (via drill 0.35)
  Top 0.26: v44.75,16.85 44.3,17.3 U$17.6 44.3,21.4 v43.5,22.2 | v46.95,16.6 v46.95,12.6 | RN7.4 49.3,8.65 v48.65,8 48.65,6.6 49.7,5.55 51.6,5.55 PCB1.P9.28 | v42.35,30.3 42.41,30.36 U$13.6 46.19,30.36 51.7,24.85 52.8,24.85 53,24.65 U$9.6
  Bottom 0.26: v44.75,16.85 46.7,16.85 v46.95,16.6 | v46.95,12.6 46.95,11 48.65,9.3 v48.65,8 | v43.5,22.2 43.5,29.15 v42.35,30.3
+3V3  (via drill 0.35)
  Top 0.26: v44.29,9.79 v44.3,9.8 | 54.92,7.22 JMP1.3
  Top 0.3: RN5.8 42.69,8.31 42.95,8.05 43.9,8.05 44.29,8.44 RN5.6 v44.29,9.79 | v50.15,10.2 50.65,10.7 U$17.18 | 52.75,7.22 RN7.8 RN7.7 RN7.6 RN7.5 | 52.75,7.22 54.92,7.22 | U$17.5 U$17.4 | U$17.5 45.57,21.73 44.8,22.5 | 44.8,22.5 44.35,22.95 35.55,22.95 34.49,24.01 U$13.18 28.21,24.01 27.05,22.85 27.05,21.9 27.23,21.73 | U$19.16 28.74,21.06 28.35,21.45 27.5,21.45 27.23,21.73 | U$21.16 25.36,19.26 26.45,20.35 26.45,21.1 27.07,21.73 27.23,21.73 | U$9.18 v46.65,34.5 | v45.55,23.3 45.55,23.25 44.8,22.5 | v51.9,18.3 52.15,18.55 52.15,22.4 51.73,22.82 U$9.5 | v52.7,10 52.7,7.28 52.75,7.22 | U$17.5 45.57,18.02 v45.55,18 45.55,14.8 v45.2,14.45
  Bottom 0.3: v44.3,9.8 45.2,10.7 v45.2,14.45 47.65,14.45 50.15,11.95 v50.15,10.2 50.35,10 v52.7,10 | v46.65,34.5 45.55,33.4 v45.55,23.3 | v45.55,18 51.6,18 v51.9,18.3
+5V  (via drill 0.35)
  Top 0.508: R7.2 70.25,20.09 v70.25,20.55 69.1,20.55 67.26,22.39 | v72.35,19.8 73.33,18.82 | 73.33,18.82 77.67,14.48 R14.1 | R2.2 67.26,22.39 | 67.26,22.39 67.26,21.81 65.85,20.4 v65.85,18.55 | v63.85,17.95 62.67,16.77 R5.2 | v63.35,21.55 64.4,21.55 64.5,21.45 U$1.5 | v61.4,12.3 61.29,12.19 U$3.8 60.04,11.59 59.45,11 v56.7,11 | 73.33,18.82 73.33,27.04 D1.3 73.55,28.51 D1.1
  Bottom 0.508: v70.25,20.55 71.6,20.55 v72.35,19.8 | v63.35,21.55 63.35,21.05 v65.85,18.55 65.25,17.95 v63.85,17.95 63.85,15.65 61.4,13.2 v61.4,12.3 | PCB1.P9.6 24.77,3 | 24.77,3 PCB1.P9.5 | 24.77,3 26,3 26.4,3 26.55,3.15 53.3,3.15 54,3.85 54,5.1 56.7,7.8 v56.7,11
+12V  (via drill 0.6)  (28 unrouted)
  Top 0.406: U$16.P$3 U$16.P$2 | U$18.P$3 U$18.P$2 | U$20.P$3 U$20.P$2 | U$22.P$3 U$22.P$2
  Top 0.508: U$18.P$2 U$18.P$1 | U$20.P$2 U$20.P$1
  Top 0.61: U$19.6 35.79,17.64 | 35.79,17.64 v36.15,18 | v32.8,21.95 32.74,21.89 U$19.11 | U$19.4 35.54,16.04 36,16.5 36,17.43 35.79,17.64 | U$19.31 32.74,11.95 | 32.74,11.95 32.74,11.54 31.94,10.74 C3.1 | U$16.P$1 U$16.P$2 | U$21.11 26.09,15.26 v26.15,15.2 | v30.3,11.9 32.69,11.9 32.74,11.95
  Top 0.813: R12.2 70.48,16.03 v70.5,16.05 | v67.4,24.95 66.1,26.25 66.1,26.95 65.2,27.85 64.6,27.85 63.5,28.95 v63.5,32 | v61.5,32.5 60.72,33.28 U$7.2 | U$23.22 U$23.21 10.91,11.25 U$22.P$1 U$22.P$2
  Bottom 0.61: v36.15,18 36.15,18.6 v32.8,21.95 32.8,22.15 32,22.95 31.15,22.95 30.2,22 30.2,17.45 28.38,15.62 | v26.15,15.2 27.95,15.2 28.38,15.62 | 28.38,15.62 30.3,13.7 v30.3,11.9
  Bottom 0.813: v70.5,16.05 68.45,18.1 68.45,21.7 67.4,22.75 v67.4,24.95 | v63.5,32 63,32.5 | 63,32.5 v61.5,32.5 | v36.15,18 38.35,20.2 50.7,20.2 63,32.5
GND  (72 unrouted)
INTERRUPT  (via drill 0.35)
  Top 0.26: RN7.3 50.1,9.3 49.85,9.55 49.45,9.55 v49.25,9.75 | PCB1.P9.25 48.95,3.12 48.95,4.95 48.3,5.6 v48.3,5.8 | v54.55,21.85 55.54,22.84 U$9.8 | v46.05,13.7 46.05,17.35 47.5,18.8 v47.5,19
  Bottom 0.26: v49.25,9.75 49.25,9.5 | 49.25,9.5 49.25,8.55 49.55,8.25 49.55,7.75 48.3,6.5 v48.3,5.8 | 49.25,9.5 47.7,11.05 47.7,13.3 47.3,13.7 v46.05,13.7 | v47.5,19 51.75,19 54.55,21.8 v54.55,21.85
N$1  (via drill 0.35)
  Top 0.26: 59.96,20.81 U$4.5 59.96,21.71 61.6,23.35 64.3,23.35 v64.4,23.45 | D2.2 71.3,25.89 v71.3,25.85 71.85,25.3 71.85,21.2 71.6,20.95 71.6,16.28 R9.2
  Bottom 0.26: v64.4,23.45 66.8,25.85 v71.3,25.85
N$2  (via drill 0.35)
  Top 0.26: C1.1 69.75,44.9 | 69.75,44.9 71.73,44.9 R1.1 | 69.75,44.9 69.74,44.89 R3.2 70,33.49 v70,32.05 | 65.15,22.7 U$1.4 | U$4.4 61.02,20.98 | 61.02,20.98 61.83,21.77 | 61.83,21.77 62.75,22.7 65.15,22.7 | 61.02,20.98 61.92,20.08 TP3.TP | U$3.3 58.44,16.04 60.05,17.65 61.35,17.65 v62,18.3 | 61.83,21.77 61.92,21.77 62.3,21.4 v62.3,21.35 | 65.15,22.7 65.15,26.35 v64.95,26.55
  Bottom 0.26: v62,18.3 62,21.05 v62.3,21.35 | v64.95,26.55 70,31.6 v70,32.05
N$3
  Top 0.26: R5.1 64.57,14.5 | 64.57,14.5 R4.2 | U$3.2 59.24,15.94 59.6,16.3 61,16.3 61.5,15.8 61.5,14.85 61.85,14.5 64.57,14.5
N$4
  Top 0.26: U$4.1 59.31,18.59 59.65,18.25 60.9,18.25 61.75,19.1 62.9,19.1 63.85,20.05 U$1.6
N$5
  Top 0.26: R6.1 58.8,19.5 59,19.7 59.8,19.7 59.96,19.54 U$4.2
N$6  (via drill 0.35)
  Top 0.26: R6.2 55.17,16.88 | 55.17,16.88 TP1.TP | U$3.1 60.51,15.69 60.8,15.4 60.8,14.15 v60.95,14 | v56.7,14.6 55.17,16.13 55.17,16.88
  Bottom 0.26: v60.95,14 60.7,13.75 57.55,13.75 v56.7,14.6
N$7
  Top 0.26: U$2.1 59.31,23.3 U$4.6
N$8  (3 unrouted)
  Top 0.26: U$5.P$8 59.35,39.4 59.35,38.65 60.08,37.92 U$7.1
N$9  (via drill 0.35)  (1 unrouted)
  Top 0.26: U$2.2 62.23,24.77 v62.85,24.15 | v67.25,20.5 67.25,19.05 R7.1
  Bottom 0.26: v62.85,24.15 62.85,22.55 | 65.6,22.25 67.25,20.6 v67.25,20.5 | 62.85,22.55 | 62.85,22.55 63.1,22.3 63.45,22.3
N$10  (1 unrouted)
  Top 0.26: D1.2 72.5,29.56 72.5,32 73.1,32.6 73.1,34.6 72.65,35.05 71.65,35.05 70.7,36 70.65,36 70.65,42.3 71.15,42.8 71.45,43.1 72.65,43.1 73.25,43.7 73.25,44.2 73.25,46.6 73,46.85
N$11  (3 unrouted)
  Top 0.26: U$23.1 10.25,46.25 11.37,47.37 U$6.P$8
N$12
  Top 0.26: R15.2 67.38,14.38 71,18 71,24.29 D2.1
  pour Top: 63,40 63.8,40 64.9,38.9 65.25,38.55 65.25,32.9 65.25,28.6 67.25,26.6 68.4,26.6 68.75,26.95 69.2,27.4 69.2,28.35 70.05,29.2 70.05,30.4 68.55,31.9 68.55,34.65 68.55,41.45 68,42 64.7,45.3 63.8,45.3 63,44.5
N$13
  Top 0.26: TP2.TP 59.6,46.75 61.5,46.75 | 61.5,46.75 R8.2 | 61.5,46.75 61.5,44.1 62.4,43.2 62.4,42.94 U$5.P$4 62.73,42.12 62.5,41.9 62.5,29.4 61.58,28.48 U$2.6
N$14
  Top 0.26: R13.1 65.95,10.19 65.95,17.3 64.5,18.75 U$1.2
N$15
  Top 0.26: U$6.P$4 14.56,44 18,44 18.88,43.12 | 18.88,43.12 RN1.4 | 18.88,43.12 20.25,44.5 21.12,44.5 U$24.P$2 U$24.P$1
N$16
  Top 0.26: RN2.4 33,39 34.38,37.62 U$13.10
N$17
  Top 0.26: RN2.5 30.3,44.2 29.5,45 27.38,45 U$24.P$15
N$18
  Top 0.26: U$17.10 37.43,14.44 U$19.2
N$19
  Top 0.26: U$19.1 37.06,13.24 39.9,10.4 | 39.9,10.4 39.95,10.35 | 39.9,10.4 40.95,10.4 41.25,10.7 41.25,11 41.63,11.38 U$17.11
N$20
  Top 0.26: LED1.A 77.67,11.53 R14.2
N$21
  Top 0.26: R15.1 69.5,7.71 LED2.A
N$22
  Top 0.26: LED3.A 70.93,11.96 R12.1
N$23  (3 unrouted)
  Top 0.26: 12.21,42.75 U$10.P$8 12.31,42.9 10.8,42.9 10.65,42.75 U$23.3
N$24
  Top 0.26: U$10.P$4 15.4,39.8 15.6,39.6 17.8,39.6 18.1,39.9 18.1,41.4 18.53,41.83 RN1.3 19.83,41.83 20.54,42.53 U$24.P$4 U$24.P$3
N$25
  Top 0.26: RN2.6 29.8,38.2 29.5,38.5 29.5,42 28.96,42.53 U$24.P$13
N$26
  Top 0.26: RN2.3 32.8,38.2 33.4,37.6 33.4,33.5 34,32.9 U$13.11
N$27  (3 unrouted)
  Top 0.26: U$23.5 11.38,39.25 U$12.P$8
N$28
  Top 0.26: U$12.P$4 15,35.92 15,38 15.8,38.8 19.9,38.8 21.09,39.99 U$24.P$6 U$24.P$5 21.46,41.03 RN1.2
N$29
  Top 0.26: RN2.7 29.7,37.4 29,38.1 29,39.8 28.8,39.99 U$24.P$11
N$30
  Top 0.26: RN2.2 32.5,37.4 32.8,37.1 32.8,32.3 33.47,31.63 U$13.12
N$31  (3 unrouted)
  Top 0.26: U$23.7 11.65,33.8 U$14.P$8
N$32  (via drill 0.35)
  Top 0.26: U$24.P$7 21.7,38 | 21.7,38 U$24.P$8 | RN1.1 19.4,39.7 v19.7,39.7 | v20.2,38.1 21.6,38.1 21.7,38 | U$14.P$4 15.42,30.72 16,31.3 v16,31.8
  Bottom 0.26: v19.7,39.7 20.5,38.9 20.5,38.5 20.2,38.2 v20.2,38.1 19.1,38.1 16,35 v16,31.8
N$33
  Top 0.26: RN2.8 28.16,36.6 U$24.P$9
N$34
  Top 0.26: RN2.1 31.86,32.15 33.64,30.36 U$13.13
N$35
  Top 0.26: U$19.10 33.54,21.14 34.05,21.65 35.75,21.65 43.03,14.37 U$17.12
N$36  (via drill 0.35)
  Top 0.26: v15.1,33.9 17.02,35.82 RN6.2
  Bottom 0.26: U$23.12 8.65,30.2 11.4,30.2 v15.1,33.9
N$37  (3 unrouted)
  Top 0.26: U$23.9 11.2,30.75 11.2,29.7 11.54,29.36 U$16.P$8
N$38
  Top 0.26: U$16.P$4 15.26,25.31 RN4.1 17.32,30.32 20.18,33.19 U$8.P$2 U$8.P$1
N$39
  Top 0.26: RN3.5 29,31.8 29,33 28.82,33.19 U$8.P$15
N$40
  Top 0.26: RN3.4 32.49,30.51 32.5,30.5 33.91,29.09 U$13.14
N$41  (3 unrouted)
  Top 0.26: U$23.11 11.2,27.25 11.2,25.7 12.2,24.7 U$18.P$8
N$42
  Top 0.26: U$18.P$4 15,22.34 15,24 15.51,24.51 RN4.2 17.61,24.51 18,24.9 18,29.9 18.8,30.7 21.7,30.7 U$8.P$4 U$8.P$3
N$43
  Top 0.26: RN3.6 29.79,29.71 28.86,30.64 U$8.P$13
N$44
  Top 0.26: RN3.3 32.29,29.71 34.18,27.82 U$13.15
N$45  (3 unrouted)
  Top 0.26: U$23.13 11.1,23.85 11.1,21.1 11.86,20.34 U$20.P$8
N$46
  Top 0.26: U$20.P$4 15.6,18.57 15.6,22.4 16.91,23.71 RN4.3 17.59,23.71 18,23.3 18,22.5 18.3,22.2 19.5,22.2 19.9,22.6 19.9,27.5 20.5,28.11 U$8.P$6 U$8.P$5
N$47
  Top 0.26: RN3.7 29.91,28.91 29,28 27.45,28 U$8.P$11
N$48
  Top 0.26: RN3.2 32.09,28.91 33,28 33,26.5 34.33,26.5 U$13.16
N$49  (3 unrouted)
  Top 0.26: U$23.15 9.7,20.3 11.5,18.5 11.5,16.4 12.16,15.74 U$22.P$8
N$50
  Top 0.26: 17.2,21.7 16.3,21.7 16.1,21.5 16.1,17.6 14.85,16.35 14.85,13.23 U$22.P$4 | 17.2,21.7 19.9,21.7 20.5,22.3 20.5,24.9 21.16,25.57 U$8.P$8 U$8.P$7 | RN4.4 17.2,22.8 17.2,21.7
N$51
  Top 0.26: RN3.8 30.29,26.79 29.07,25.57 U$8.P$9
N$52
  Top 0.26: RN3.1 31.84,26.16 32.72,25.28 U$13.17
N$53
  Top 0.26: U$11.P$2 U$11.P$1 44.77,36.73 45.3,36.2 45.3,32.2 47,30.5 56.05,30.5 56.81,31.26 U$9.10
N$54  (via drill 0.35)
  Top 0.26: U$11.P$4 U$11.P$3 43.23,39.27 v45.15,37.35 | v53.8,34.75 55,34.75 55.54,34.21 U$9.11
  Bottom 0.26: v45.15,37.35 47.75,34.75 v53.8,34.75
N$55  (via drill 0.35)
  Top 0.26: RN6.5 20.08,34.22 v20.1,34.2 | v34,39.5 34.3,39.2 34.3,38.5 34.8,37.99 U$11.P$15
  Bottom 0.26: v20.1,34.2 28.5,34.2 30.2,35.9 30.4,35.9 v34,39.5
N$56  (via drill 0.35)
  Top 0.26: U$11.P$6 U$11.P$5 42.34,41.8 v45.8,38.35 | v53.45,35.8 53.05,35.4 53.05,33.95 53.5,33.95 54.27,33.18 U$9.12
  Bottom 0.26: v45.8,38.35 46,38.35 48.55,35.8 v53.45,35.8
N$57  (via drill 0.35)
  Top 0.26: U$11.P$8 U$11.P$7 43.26,44.34 48.15,39.45 v52.35,39.45 | v52.55,36.5 52.55,33.45 U$9.13
  Bottom 0.26: v52.35,39.45 52.35,36.7 v52.55,36.5
N$58
  Top 0.26: U$15.P$2 U$15.P$1 45.8,37.05 45.8,32.4 47.2,31 51.1,31 51.73,31.63 U$9.14
N$59
  Top 0.26: U$9.15 50.53,33.07 U$15.P$4 U$15.P$3
N$60  (via drill 0.35)
  Top 0.26: U$9.16 49.19,33.69 v49.65,34.15 | v51.25,34.2 51.8,34.76 U$15.P$5 U$15.P$6
  Bottom 0.26: v49.65,34.15 51.2,34.15 v51.25,34.2
N$61  (via drill 0.35)
  Top 0.26: U$9.17 47.92,31.88 v48.05,31.75 | v54.35,36.3 U$15.P$7 U$15.P$8
  Bottom 0.26: v48.05,31.75 52.5,31.75 52.6,31.75 53.45,31.75 54.6,32.9 54.6,36.05 v54.35,36.3
N$62  (via drill 0.35)
  Top 0.26: RN6.6 20.02,35.02 20.3,35.3 26.4,35.3 26.9,35.8 v28.9,35.8 | v33,40.5 35.66,40.5 U$11.P$13
  Bottom 0.26: v28.9,35.8 33,39.9 v33,40.5
N$63  (via drill 0.35)
  Top 0.26: RN6.7 24.38,35.82 24.4,35.8 24.9,36.3 v24.9,44.5 | v32,43.3 32.23,43.08 U$11.P$11
  Bottom 0.26: v24.9,44.5 30.8,44.5 v32,43.3
N$64  (via drill 0.35)
  Top 0.26: RN6.8 24.08,36.62 24.1,36.6 24.1,45.6 v24,45.7 | v31.8,45.7 31.89,45.62 U$11.P$9
  Bottom 0.26: v24,45.7 v31.8,45.7
N$65
  Top 0.26: RN8.5 19.42,45.42 20.4,46.4 20.4,46.8 21.1,47.5 47.5,47.5 48,47 47.99,46.99 U$15.P$15
N$66  (via drill 0.35)
  Top 0.26: U$17.13 44.3,11.15 43.6,10.45 41.7,10.45 41.15,9.9 40.75,9.9 v40.45,9.6 | v26.05,16.9 26.11,16.84 U$19.21 | v39.85,7.3 39.92,7.22 RN5.1
  Bottom 0.26: v40.45,9.6 39.5,9.6 | 39.5,9.6 31.75,9.6 30.85,9.6 29.1,11.35 29.1,11.9 28.2,12.8 25.5,12.8 24.25,14.05 24.25,15.1 v26.05,16.9 | 39.5,9.6 39.5,7.65 v39.85,7.3
N$67  (via drill 0.35)
  Top 0.26: v40.1,13 37.7,15.4 37.7,17.8 36.25,19.25 36.24,19.24 U$19.8 | RN5.7 43.49,9.29 43.13,9.65 v42.2,9.65
  Bottom 0.26: 40.2,13 v40.1,13 40.45,13 42.2,11.25 v42.2,9.65
N$68  (via drill 0.35)
  Top 0.26: U$21.2 18.74,12.31 v19.3,11.75 | v45.45,9.9 45.57,10.02 U$17.14
  Bottom 0.26: v19.3,11.75 19.3,10.75 21,9.05 29.35,9.05 31.6,6.8 39.25,6.8 40.3,5.75 45.8,5.75 46.2,5.35 47,5.35 47.6,5.95 47.6,8.95 47,9.55 45.8,9.55 v45.45,9.9
N$69  (via drill 0.35)
  Top 0.26: U$17.15 v46.84,8.51 v46.85,8.5 | v46.7,6.15 46.25,5.7 16.5,5.7 v15.5,6.7 | v16.2,12 17.46,13.26 U$21.1
  Bottom 0.26: v46.85,8.5 46.85,6.3 v46.7,6.15 | v15.5,6.7 15.5,11.3 v16.2,12
N$70
  Top 0.26: RN8.6 19.12,46.22 20.9,48 50,48 50.53,47.47 U$15.P$13
N$71
  Top 0.26: U$15.P$11 53.1,43.6 53.1,47.8 52.4,48.5 21.4,48.5 21.1,48.5 20.6,48.5 19.12,47.02 RN8.7
N$72
  Top 0.26: U$15.P$9 55.6,43.59 55.6,47.7 54.3,49 20.05,49 RN8.8
N$73  (via drill 0.35)
  Top 0.26: U$21.10 25.59,14.46 26.6,13.45 26.6,12.45 27.45,11.6 v28,11.6 | U$17.16 48.11,15.64 v47.9,15.85 | v36.05,15.25 36.9,16.1 v36.9,17.1 | v30.7,10.8 v29.65,9.75
  Bottom 0.26: v36.05,15.25 36.05,13.4 33.45,10.8 v30.7,10.8 | v36.9,17.1 38.15,15.85 v47.9,15.85 | v29.65,9.75 29.65,9.85 28.57,10.93 28.57,11.03 v28,11.6
N$74  (via drill 0.35)
  Top 0.26: U$21.21 21.14,21.64 v21.15,21.9 | v41.5,6.5 44.3,6.5 | 44.3,6.5 45.9,6.5 47.65,8.25 47.65,9.35 48.8,10.5 49.1,10.5 49.38,10.78 U$17.17 | RN5.3 44.29,6.51 44.3,6.5 | v29.35,23.1 30.05,23.1 v31.35,21.8
  Bottom 0.26: v41.5,6.5 40.55,7.45 40.55,8.65 41.3,9.4 41.3,10.3 40.9,10.7 40.1,10.7 37.6,13.2 37.6,15.2 35.25,17.55 35.25,17.9 v31.35,21.8 | v21.15,21.9 22.35,23.1 28.5,23.1 28.7,23.1 v29.35,23.1
N$75  (via drill 0.35)
  Top 0.26: 45.09,8.49 RN5.5 45.9,7.96 v45.9,7.55 | U$21.8 23.54,12.76 24.15,12.15 26.2,12.15 27.35,11 27.35,7.8 28.9,6.25 37.25,6.25 39.05,8.05 41.3,8.05 v41.4,7.95
  Bottom 0.26: v45.9,7.55 41.8,7.55 v41.4,7.95
N$76
  Top 0.26: LED4.A LED5.C 18.69,8.64 R18.1
N$77  (via drill 0.35)
  Top 0.26: LED4.C 17.5,10.55 | 17.5,10.55 LED5.A | v17.5,11.7 17.5,10.55 | U$19.30 U$19.29 U$19.28 U$19.27 29.54,12.29 29.45,12.2 29.45,11.6 v28.15,10.3
  Bottom 0.26: v17.5,11.7 18.55,12.75 | 18.55,12.75 18.75,12.95 19.5,12.95 20.05,12.4 20.05,10.75 21.2,9.6 27.45,9.6 v28.15,10.3 | U$23.19 9.7,14.3 11.75,12.25 15.35,12.25 15.85,12.75 18.55,12.75
N$78  (via drill 0.35)
  Top 0.26: v15.2,47.7 17.2,47.7 RN8.1
  Bottom 0.26: U$23.2 8.65,47.7 v15.2,47.7
N$79  (via drill 0.35)  (1 unrouted)
  Top 0.26: 20.8,10.62 R18.2 21.74,10.54 v22.25,11.05 | 32.1,20.6 U$19.12 U$19.13 U$19.14 U$19.15 29.55,21.4 28.7,22.25 v27.9,22.25
  Bottom 0.26: U$23.17 14.45,13.5 20.35,13.5 22.25,11.6 v22.25,11.05 | v27.9,22.25 27.5,21.85 27.5,18.4 26.75,17.65 24.5,17.65 23.15,16.3 23.15,12.85
N$80
  Top 0.26: R19.1 22.64,7.5 16.45,7.5 16,7.5 15.56,7.5 LED7.C LED6.A
N$81  (via drill 0.35)
  Top 0.26: U$21.27 U$21.28 U$21.29 U$21.30 15.51,16.06 15.35,15.9 15.35,12.5 14.5,11.65 14.5,10.55 | LED6.C 13.5,10.55 | 13.5,10.55 14.5,10.55 | 14.5,10.55 LED7.A | v13.5,11.45 13.5,10.55
  Bottom 0.26: U$23.20 9.15,12.8 10.4,12.8 11.6,11.6 13.35,11.6 v13.5,11.45
N$82  (via drill 0.35)  (1 unrouted)
  Top 0.26: U$21.12 U$21.13 U$21.14 U$21.15 25.61,18.46 v26.1,18.95 | R19.2 24.94,10.34 v25,10.4
  Bottom 0.26: U$23.18 8.85,19.9 10.8,19.9 11.2,20.3 11.2,20.6 11.75,21.15 24.4,21.15 25.45,22.2 26.3,22.2 26.85,21.65 26.85,19.7 v26.1,18.95 24.45,18.95 22,16.5 22,13.25
N$83  (via drill 0.35)
  Top 0.26: U$21.32 16.89,14.46 v16.3,15.05 | C2.2 25.61,21.45 v25.8,21.45
  Bottom 0.26: v25.8,21.45 24.1,19.75 21,19.75 v16.3,15.05
N$84
  Top 0.26: C3.2 33.54,10.44 U$19.32
N$85  (via drill 0.35)
  Top 0.26: v15.2,46.2 16,47 17.3,47 RN8.2
  Bottom 0.26: U$23.4 8.65,44.2 10.9,44.2 12.9,46.2 v15.2,46.2 15.3,46.2
N$86  (via drill 0.35)
  Top 0.26: v15.2,45.2 15.3,45.2 16.32,46.22 RN8.3
  Bottom 0.26: U$23.6 8.65,40.7 11.2,40.7 12.4,41.9 12.4,45 12.6,45.2 v15.2,45.2
N$87  (via drill 0.35)
  Top 0.26: v16.1,44.8 16.72,45.42 RN8.4
  Bottom 0.26: U$23.8 8.65,37.2 11.1,37.2 12.9,39 15,39 16.1,40.1 v16.1,44.8
N$88  (via drill 0.35)
  Top 0.26: v15.9,36.2 16.32,36.62 RN6.1
  Bottom 0.26: U$23.10 8.65,33.7 13.5,33.7 15.9,36.1 v15.9,36.2
N$89  (via drill 0.35)
  Top 0.26: v15.2,32.5 15.2,32.7 16.5,34 16.5,34.5 17.02,35.02 RN6.3
  Bottom 0.26: U$23.14 8.65,26.7 10.6,26.7 15.2,31.3 v15.2,32.5
N$90  (via drill 0.35)
  Top 0.26: RN6.4 17.32,33.52 16.8,33 16.8,28.2 v15.2,26.6
  Bottom 0.26: U$23.16 8.65,23.2 11.8,23.2 v15.2,26.6
N$92  (via drill 0.35)
  Top 0.26: U$13.3 48.15,26.55 49.2,25.5 49.19,25.49 U$9.3 49.19,22.99 48.11,21.91 U$17.3 48.45,20.62 v48.45,17.2 | v53.4,11.05 53.4,10.3 54.7,9 JMP1.2
  Bottom 0.26: v53.4,11.05 51.9,11.05 48.85,14.1 48.85,16.8 v48.45,17.2
PWR_EN
  Top 0.26: PCB1.P9.27 53.95,3.15 53.95,5.2 54.8,6.05 56.05,6.05 57.45,7.45 57.45,8.95 57.95,9.45 R10.2 59.23,9.68 R13.2
SCL  (via drill 0.35)
  Top 0.26: U$13.1 44.96,24.01 45.15,24.2 45.87,24.2 U$9.1 46.65,22.9 v47.35,22.2 | v51.25,22.2 50.65,21.6 U$17.1 50.65,16.75 v50.7,16.7 | v49.75,14.75 49.75,14.05 51.4,12.4 51.4,10.1 50.9,9.6 RN7.2
  Bottom 0.26: v47.35,22.2 48.05,21.5 50.55,21.5 v51.25,22.2 | v50.7,16.7 49.75,15.75 v49.75,14.75 50.8,14.75 54.2,11.35 54.2,10 50.5,6.3 49.48,6.3 49.05,5.87 49.05,4.8 48.7,4.45 PCB1.P9.24
SDA  (via drill 0.35)
  Top 0.26: U$13.2 47,25.28 | 47,25.28 47.47,25.28 47.92,24.83 U$9.2 | 47,25.28 47.42,25.7 v47.9,25.7 | v49.8,22.3 49.38,21.88 U$17.2 49.38,16.22 50.55,15.05 52.15,13.45 52.15,12.25 | RN7.1 51.9,8.97 51.9,10.25 52.15,10.5 52.15,12.25 | v54.75,12.25 52.15,12.25
  Bottom 0.26: v47.9,25.7 49.45,25.7 49.95,25.2 49.95,22.45 v49.8,22.3 | v54.75,12.25 54.75,7.65 53.45,6.35 52.07,6.35 PCB1.P9.26